# EAGLE design fotocellule (EAGLE 7.2.0)
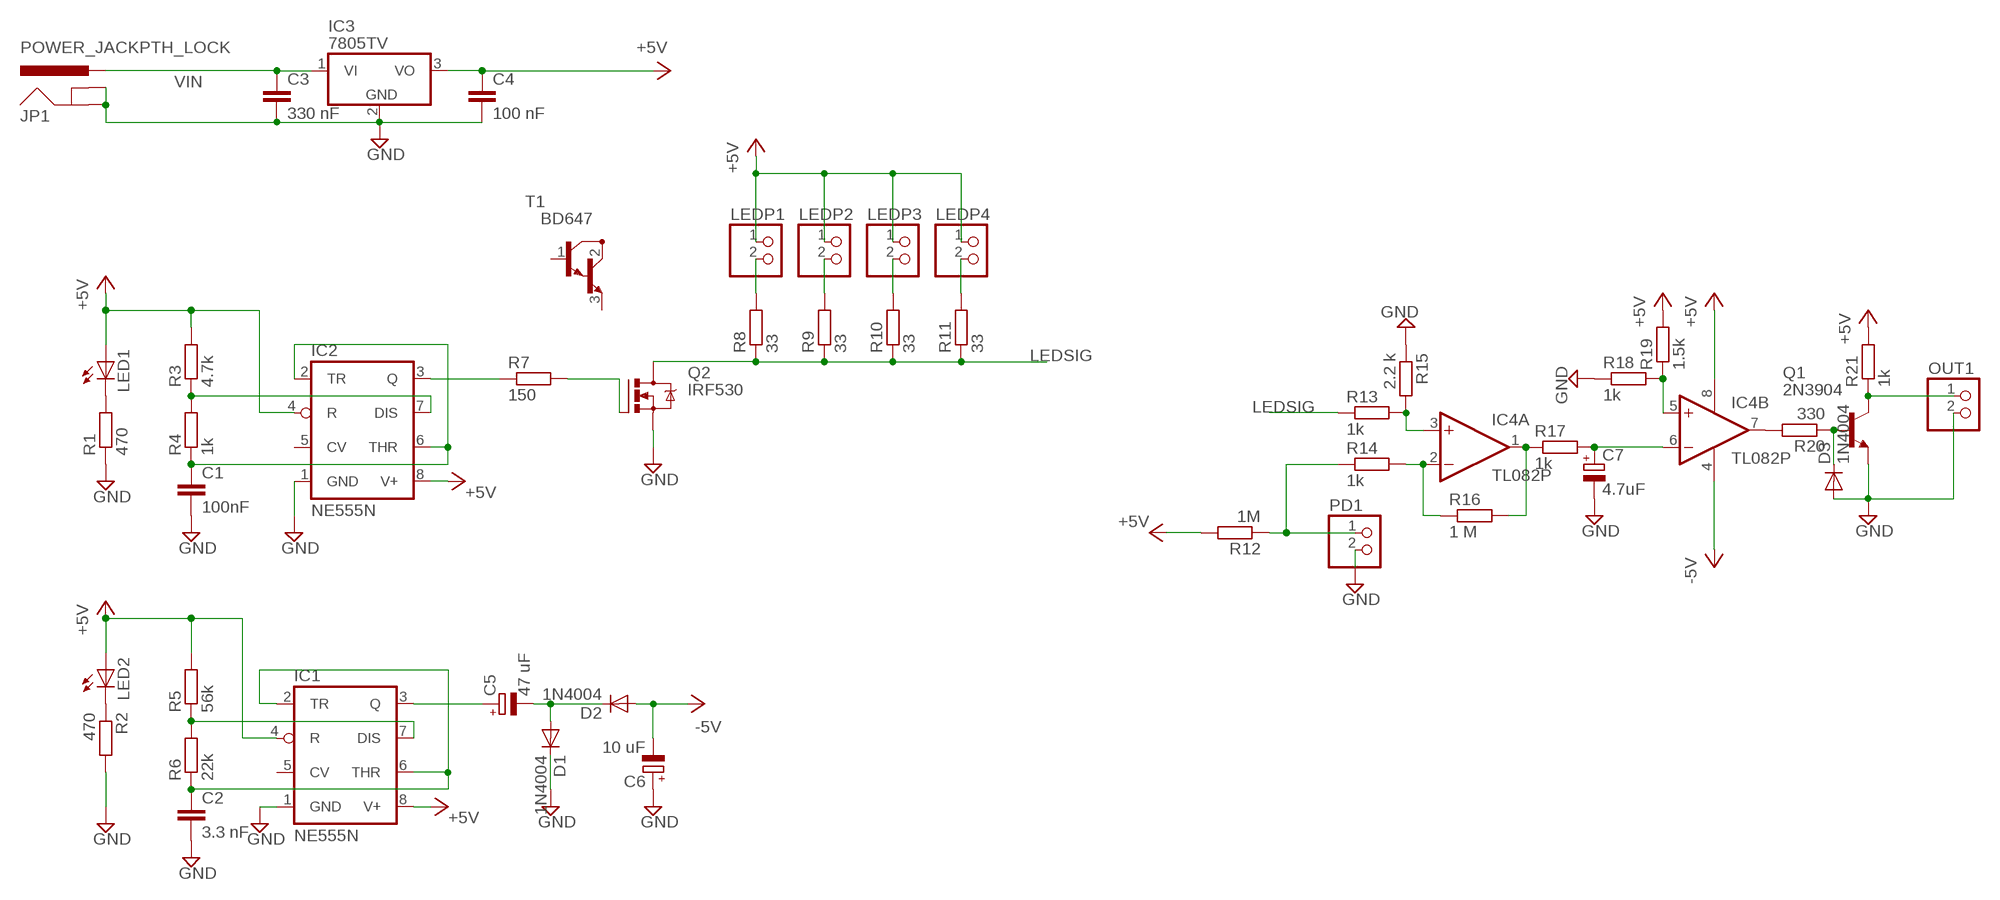
[diagram p0: schematic, sheet 1]

## Parts
C1  100nF  C-EU025-024X044  [C025-024X044]
C2  3.3 nF  C-EU025-024X044  [C025-024X044]
C3  330 nF  C-EU025-024X044  [C025-024X044]
C4  100 nF  C-EU025-024X044  [C025-024X044]
C5  47 uF  CPOL-EUE2.5-5  [E2,5-5]
C6  10 uF  CPOL-EUE2.5-5  [E2,5-5]
C7  4.7uF  CPOL-EUE2.5-6  [E2,5-6]
D1  1N4004  [DO41-10]
D2  1N4004  [DO41-10]
D3  1N4004  [DO41-10]
IC1  NE555N  [DIL08]
IC2  NE555N  [DIL08]
IC3  7805TV  [TO220V]
IC4  TL082P  [DIL08]
JP1  POWER_JACKPTH_LOCK  [POWER_JACK_PTH_LOCK]
LED1  LED5MM  [LED5MM]
LED2  LED5MM  [LED5MM]
LEDP1  PINHD-1X2  [1X02]
LEDP2  PINHD-1X2  [1X02]
LEDP3  PINHD-1X2  [1X02]
LEDP4  PINHD-1X2  [1X02]
OUT1  PINHD-1X2  [1X02]
PD1  PINHD-1X2  [1X02]
Q1  2N3904  [TO92]
Q2  IRF530  [TO220BV]
R1  470  R-EU_0207/10  [0207/10]
R2  470  R-EU_0207/10  [0207/10]
R3  4.7k  R-EU_0207/10  [0207/10]
R4  1k  R-EU_0207/10  [0207/10]
R5  56k  R-EU_0207/10  [0207/10]
R6  22k  R-EU_0207/10  [0207/10]
R7  150  R-EU_0207/10  [0207/10]
R8  33  R-EU_0207/10  [0207/10]
R9  33  R-EU_0207/10  [0207/10]
R10  33  R-EU_0207/10  [0207/10]
R11  33  R-EU_0207/10  [0207/10]
R12  1M  R-EU_0207/10  [0207/10]
R13  1k  R-EU_0207/10  [0207/10]
R14  1k  R-EU_0207/10  [0207/10]
R15  2.2 k  R-EU_0207/10  [0207/10]
R16  1 M  R-EU_0207/10  [0207/10]
R17  1k  R-EU_0207/10  [0207/10]
R18  1k  R-EU_0207/10  [0207/10]
R19  1.5k  R-EU_0207/10  [0207/10]
R20  330  R-EU_0207/10  [0207/10]
R21  1k  R-EU_0207/10  [0207/10]
T1  BD647  [TO220]

## Nets
+5V: C4.1 IC1.4(R) IC1.8(V+) IC2.4(R) IC2.8(V+) IC3.3(VO) IC4.8(P:V+) LED1.A LED2.A LEDP1.1 LEDP2.1 LEDP3.1 LEDP4.1 R3.2 R5.2 R12.2 R19.2 R21.2
-5V: C6.- D2.A IC4.4(P:V-)
GND: C1.2 C2.2 C3.2 C4.2 C6.+ C7.- D1.C D3.A IC1.1(GND) IC2.1(GND) IC3.2(GND) JP1.GND JP1.GNDBREAK OUT1.2 PD1.2 Q1.3(E) Q2.S R1.1 R2.2 R15.1 R18.1
LEDSIG: Q2.D R8.1 R9.1 R10.1 R11.1 R13.1
N$1: C1.1 IC2.2(TR) IC2.6(THR) R4.1
N$2: IC2.7(DIS) R3.1 R4.2
N$3: IC4.3(A:+IN) R13.2 R15.2
N$4: IC4.1(A:OUT) R16.2 R17.1
N$5: C7.+ IC4.6(B:-IN) R17.2
N$6: IC4.5(B:+IN) R18.2 R19.1
N$7: C2.1 IC1.2(TR) IC1.6(THR) R6.1
N$8: IC1.7(DIS) R5.1 R6.2
N$9: IC2.3(Q) R7.1
N$10: C5.+ IC1.3(Q)
N$11: C5.- D1.A D2.C
N$12: Q2.G R7.2
N$13: IC4.7(B:OUT) R20.2
N$14: LED1.K(C) R1.2
N$15: LEDP1.2 R8.2
N$16: OUT1.1 Q1.1(C) R21.1
N$17: LEDP2.2 R9.2
N$18: D3.C Q1.2(B) R20.1
N$19: LEDP3.2 R10.2
N$20: LEDP4.2 R11.2
N$21: IC4.2(A:-IN) R14.2 R16.1
N$22: PD1.1 R12.1 R14.1
N$32: LED2.K(C) R2.1
VIN: C3.1 IC3.1(VI) JP1.PWR
Unconnected: IC1.5(CV) IC2.5(CV) T1.1(B) T1.2(C) T1.3(E)

## Library data of the parts
C1-C4 = resistor:C-EU: CAPACITOR, European symbol
C5 C6 = rcl:CPOL-EU: POLARIZED CAPACITOR, European symbol
C7 = resistor:CPOL-EU: POLARIZED CAPACITOR, European symbol
D1-D3 = diode:1N4004: DIODE general purpose rectifier, 1 A
IC1 IC2 = linear:*555: TIMER
IC3 = linear:78*: Positive VOLTAGE REGULATOR Source: http://cache.national.com/ds/LM/LM78L05.pdf http://www.fairchildsemi.com/ds/LM/LM7805.pdf
IC4 = linear:TL082: OP AMP Data sheet <http://www.ti.com/lit/ds/symlink/tl084a . pdf>; DATA_SHEET: <a href="http://www.ti.com/lit/ds/symlink/tl084a.pdf"> Data sheet </a>
JP1 = SparkFun-Connectors:POWER_JACK: Power Jack This is the standard 5.5mm barrel jack for power. The PTH is the most common, proven, reliable, footprint. The Slot footprint only works if the mill layer is transmitted to the PCB fab house so be warned. Mating wall wart : TOL-00298 (and others); PROD_ID: CONN-08197; SF_ID: PRT-00119
LED1 LED2 = led:LED: LED OSRAM: - CHIPLED LG R971, LG N971, LY N971, LG Q971, LY Q971, LO R971, LY R971 LH N974, LH R974 LS Q976, LO Q976, LY Q976 LO Q996 - Hyper CHIPLED LW Q18S LB Q993, LB Q99A, LB R99A - SideLED LS A670, LO A670, LY A670, LG A670, LP A670 LB A673, LV A673, LT A673, LW A673 LH A674 LY A675 LS A676, LA A676, LO A676, LY A676, LW A676 LS A679, LY A679, LG A679 - Hyper Micro SIDELED® LS Y876, LA Y876, LO Y876, LY Y876 LT Y87S - SmartLED LW L88C, LW L88S LB L89C, LB L89S, LG L890 LS L89K, LO L89K, LY L89K LS L896, LA L896, LO L896, LY L896 - TOPLED LS T670, LO T670, LY T670, LG T670, LP T670 LSG T670, LSP T670, LSY T670, LOP T670, LYG T670 LG T671, LOG T671, LSG T671 LB T673, LV T673, LT T673, LW T673 LH T674 LS T676, LA T676, LO T676, LY T676, LB T676, LH T676, LSB T676, LW T676 LB T67C, LV T67C, LT T67C, LS T67K, LO T67K, LY T67K, LW E67C LS E67B, LA E67B, LO E67B, LY E67B, LB E67C, LV E67C, LT E67C LW T67C LS T679, LY T679, LG T679 LS T770, LO T770, LY T770, LG T770, LP T770 LB T773, LV T773, LT T773, LW T773 LH T774 LS E675, LA E675, LY E675, LS T675 LS T776, LA T776, LO T776, LY T776, LB T776 LHGB T686 LT T68C, LB T68C - Hyper Mini TOPLED® LB M676 - Mini TOPLED Santana® LG M470 LS M47K, LO M47K, LY M47K Source: http://www.osram.convergy.de LUXEON: - LUMILED® LXK2-PW12-R00, LXK2-PW12-S00, LXK2-PW14-U00, LXK2-PW14-V00 LXK2-PM12-R00, LXK2-PM12-S00, LXK2-PM14-U00 LXK2-PE12-Q00, LXK2-PE12-R00, LXK2-PE12-S00, LXK2-PE14-T00, LXK2-PE14-U00 LXK2-PB12-K00, LXK2-PB12-L00, LXK2-PB12-M00, LXK2-PB14-N00, LXK2-PB14-P00, LXK2-PB14-Q00 LXK2-PR12-L00, LXK2-PR12-M00, LXK2-PR14-Q00, LXK2-PR14-R00 LXK2-PD12-Q00, LXK2-PD12-R00, LXK2-PD12-S00 LXK2-PH12-R00, LXK2-PH12-S00 LXK2-PL12-P00, LXK2-PL12-Q00, LXK2-PL12-R00 Source: www.luxeon.com KINGBRIGHT: KA-3528ASYC Source: www.kingbright.com
LEDP1-LEDP4 OUT1 PD1 = pinhead:PINHD-1X2: PIN HEADER
Q1 = transistor-npn:2N3904: NPN Transistor
Q2 = transistor-power:IRF530: HEXFET Power MOSFET
R1-R21 = resistor:R-EU_: RESISTOR, European symbol
T1 = transistor:BD647: NPN BIPOLAR DARLINGTON TRANSISTOR

## Board
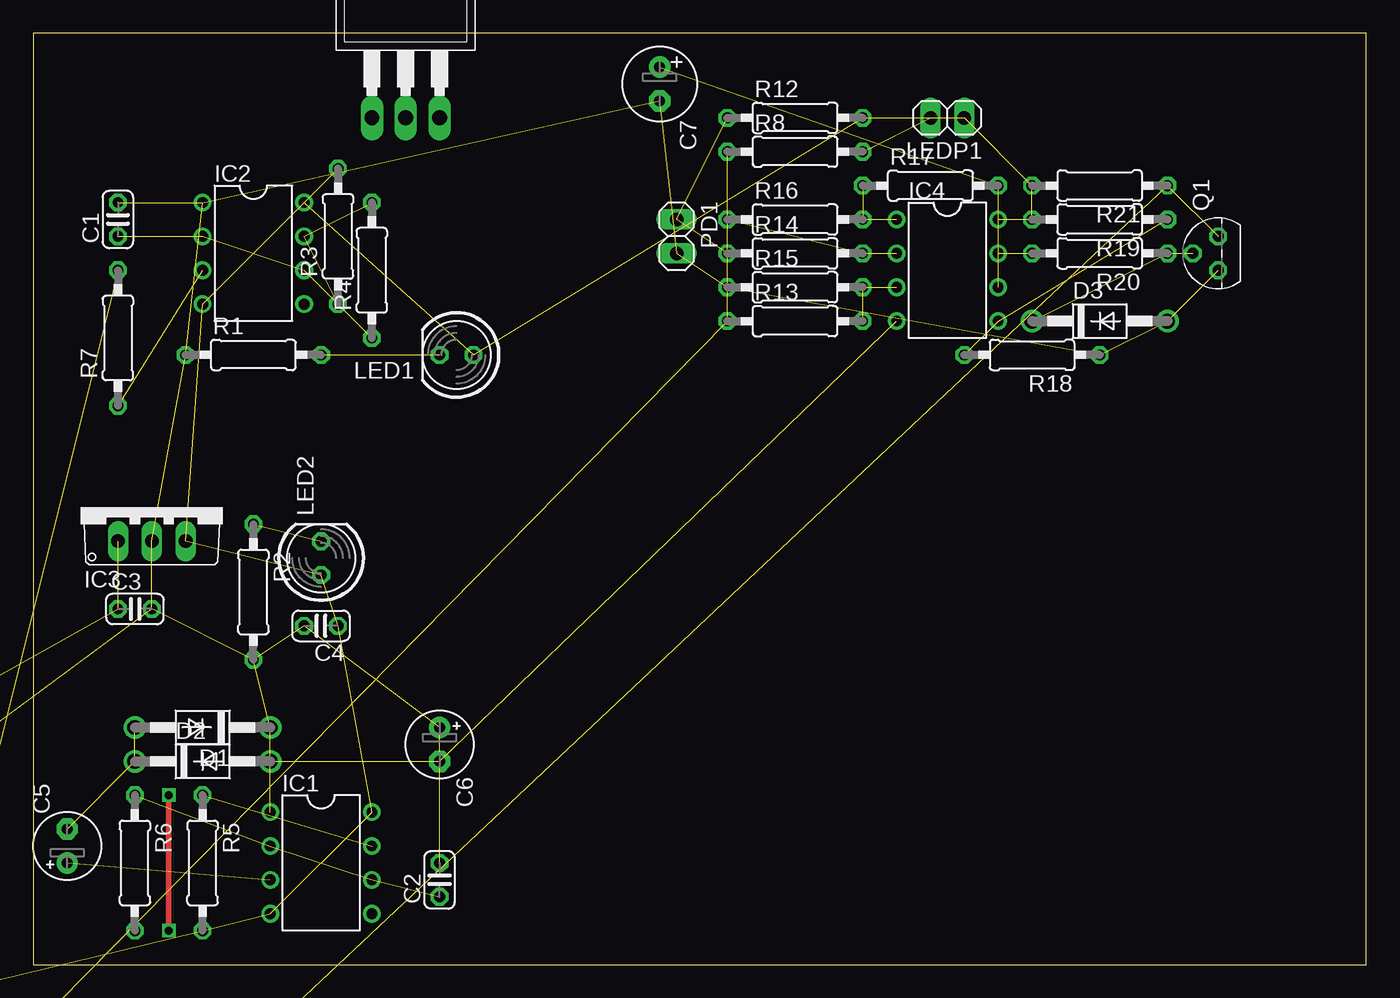
[diagram p1: board, top side]
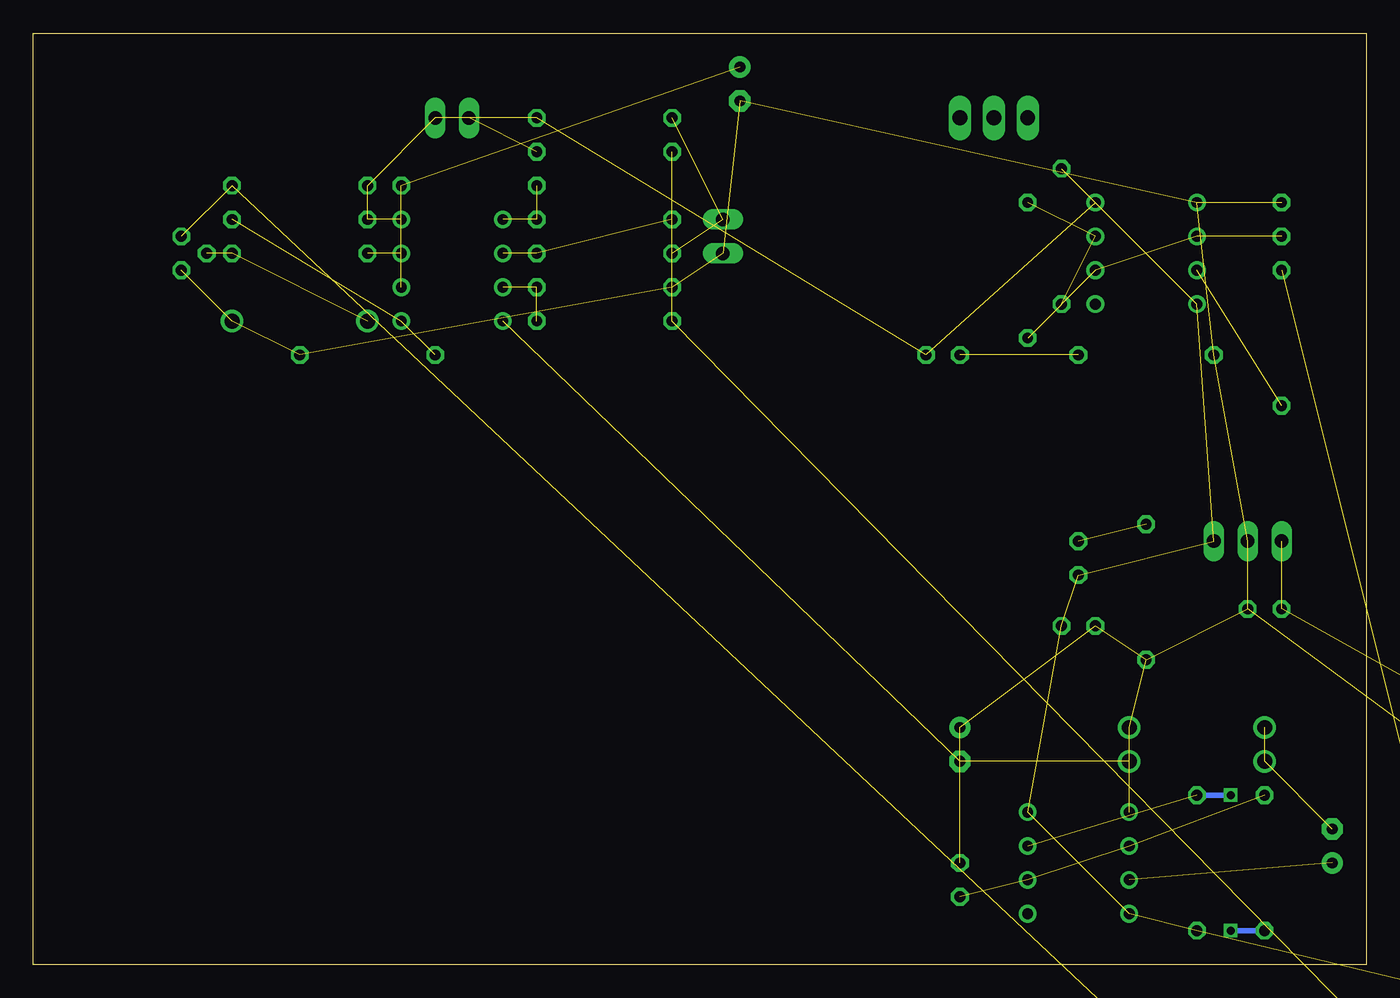
[diagram p2: board, bottom side, seen from below]

Size 100 x 69.84 mm. Coordinates in mm from the lower left corner, seen from the top.
Outline: 0,0 100,0 100,69.84 0,69.84 0,0
Copper layers (1*16): Top 0.035mm / dielectric 1.5mm / Bottom 0.035mm
Design rules "default *": minimum track width 0.8mm, minimum drill 0.8mm, track to track 20mil, track to pad 20mil, pad to pad 8mil, via to via 8mil, smd to smd 8mil, copper to edge 40mil, drill to drill 8mil, minimum pad ring 10mil, minimum via ring 8mil, stop-mask expansion 4mil, vias tented up to drill 0mil, thermal gap 10mil

### Footprints (pad centres in the part's own frame; a part is rotated, then mirrored left to right if it is on the bottom)
C025-024X044 = drill 0.813 octagon: 1 -1.27,0; 2 1.27,0
E2,5-5 = drill 0.813 pad 1.6: + -1.27,0 | drill 0.813 pad 1.6 octagon: - 1.27,0
E2,5-6 = drill 0.813 pad 1.6: + -1.27,0 | drill 0.813 pad 1.6 octagon: - 1.27,0
DO41-10 = drill 1.118: A 5.08,0; C -5.08,0
DIL08 = drill 0.813 pad 1.27: 1 -3.81,-3.81; 2 -1.27,-3.81; 3 1.27,-3.81; 4 3.81,-3.81; 5 3.81,3.81; 6 1.27,3.81; 7 -1.27,3.81; 8 -3.81,3.81
TO220V = drill 1.016 long: 1 -2.54,-2.54; 2 0,-2.54; 3 2.54,-2.54
POWER_JACK_PTH_LOCK = drill 2.997 pad 4.115: GND 0.025,6.557; GNDBREAK 3.762,10.7 | drill 3.2 pad 4.115: PWR 0,13.878
LED5MM = drill 0.813 octagon: A -1.27,0; K 1.27,0
1X02 = drill 1.016 long: 1 -1.27,0; 2 1.27,0
TO92 = drill 0.813 octagon: 1 1.27,0; 2 0,1.905; 3 -1.27,0
TO220BV = drill 1.016 long: D 0,-2.54; G -2.54,-2.54; S 2.54,-2.54
0207/10 = drill 0.813 octagon: 1 -5.08,0; 2 5.08,0
TO220 = drill 1.118 long: 1 -2.54,-6.35; 2 0,-6.35; 3 2.54,-6.35 | hole 3.302: 0,11.176

### Placement (x,y rotation side)
C1  6.35,55.88 90 top
C2  30.48,6.35 90 top
C3  7.62,26.67 0 top
C4  21.59,25.4 180 top
C5  2.54,8.89 90 top
C6  30.48,16.51 270 top
C7  46.99,66.04 270 top
D1  12.7,17.78 180 top
D2  12.7,15.24 0 top
D3  80.01,48.26 0 top
IC1  21.59,7.62 270 top
IC2  16.51,53.34 270 top
IC3  8.89,34.29 0 top
IC4  68.58,52.07 270 top
JP1  -16.51,0 0 top  (outside the outline)
LED1  31.75,45.72 180 top
LED2  21.59,30.48 90 top
LEDP1  68.58,63.5 180 top
LEDP2  -17.78,-5.08 0 top  (outside the outline)
LEDP3  -17.78,-11.43 0 top  (outside the outline)
LEDP4  -17.78,-17.78 0 top  (outside the outline)
OUT1  -17.78,-39.37 0 top  (outside the outline)
PD1  48.26,54.61 270 top
Q1  88.9,53.34 90 top
Q2  -15.24,-41.91 0 top  (outside the outline)
R1  16.51,45.72 0 top
R2  16.51,27.94 270 top
R3  22.86,54.61 90 top
R4  25.4,52.07 90 top
R5  12.7,7.62 270 top
R6  7.62,7.62 270 top
R7  6.35,46.99 90 top
R8  57.15,60.96 0 top
R9  -13.97,-24.13 0 top  (outside the outline)
R10  -13.97,-29.21 0 top  (outside the outline)
R11  -13.97,-34.29 0 top  (outside the outline)
R12  57.15,63.5 0 top
R13  57.15,48.26 0 top
R14  57.15,53.34 0 top
R15  57.15,50.8 0 top
R16  57.15,55.88 0 top
R17  67.31,58.42 0 top
R18  74.93,45.72 180 top
R19  80.01,55.88 180 top
R20  80.01,53.34 180 top
R21  80.01,58.42 180 top
T1  27.94,69.85 0 top

### Tracks (layer width: path | path; a pad name or v marks a point on that pad's centre or on a via)
+5V  (17 unrouted)
-5V  (2 unrouted)
GND  (20 unrouted)
LEDSIG  (5 unrouted)
N$1  (3 unrouted)
N$2  (2 unrouted)
N$3  (2 unrouted)
N$4  (2 unrouted)
N$5  (2 unrouted)
N$6  (2 unrouted)
N$7  (3 unrouted)
N$8  (via drill 0.6)  (1 unrouted)
  Top 0.406: v10.16,12.7 v10.16,2.54
  Bottom 0.406: R5.1 v10.16,12.7 | v10.16,2.54 R6.2
N$9  (1 unrouted)
N$10  (1 unrouted)
N$11  (2 unrouted)
N$12  (1 unrouted)
N$13  (1 unrouted)
N$14  (1 unrouted)
N$15  (1 unrouted)
N$16  (2 unrouted)
N$17  (1 unrouted)
N$18  (2 unrouted)
N$19  (1 unrouted)
N$20  (1 unrouted)
N$21  (2 unrouted)
N$22  (2 unrouted)
N$32  (1 unrouted)
VIN  (2 unrouted)